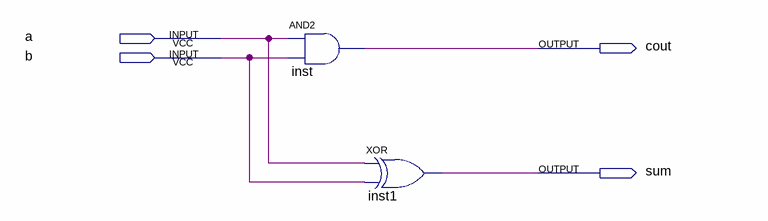
[diagram p0: schematic sheet]
// Quartus schematic half_adder.bdf as structural Verilog: 2 symbols, 4 pins
module half_adder (
  input  a,
  input  b,
  output cout,
  output sum
);

  and inst (cout, a, b);
  xor inst1 (sum, a, b);
endmodule
